# Altium project Board2.PrjPcb
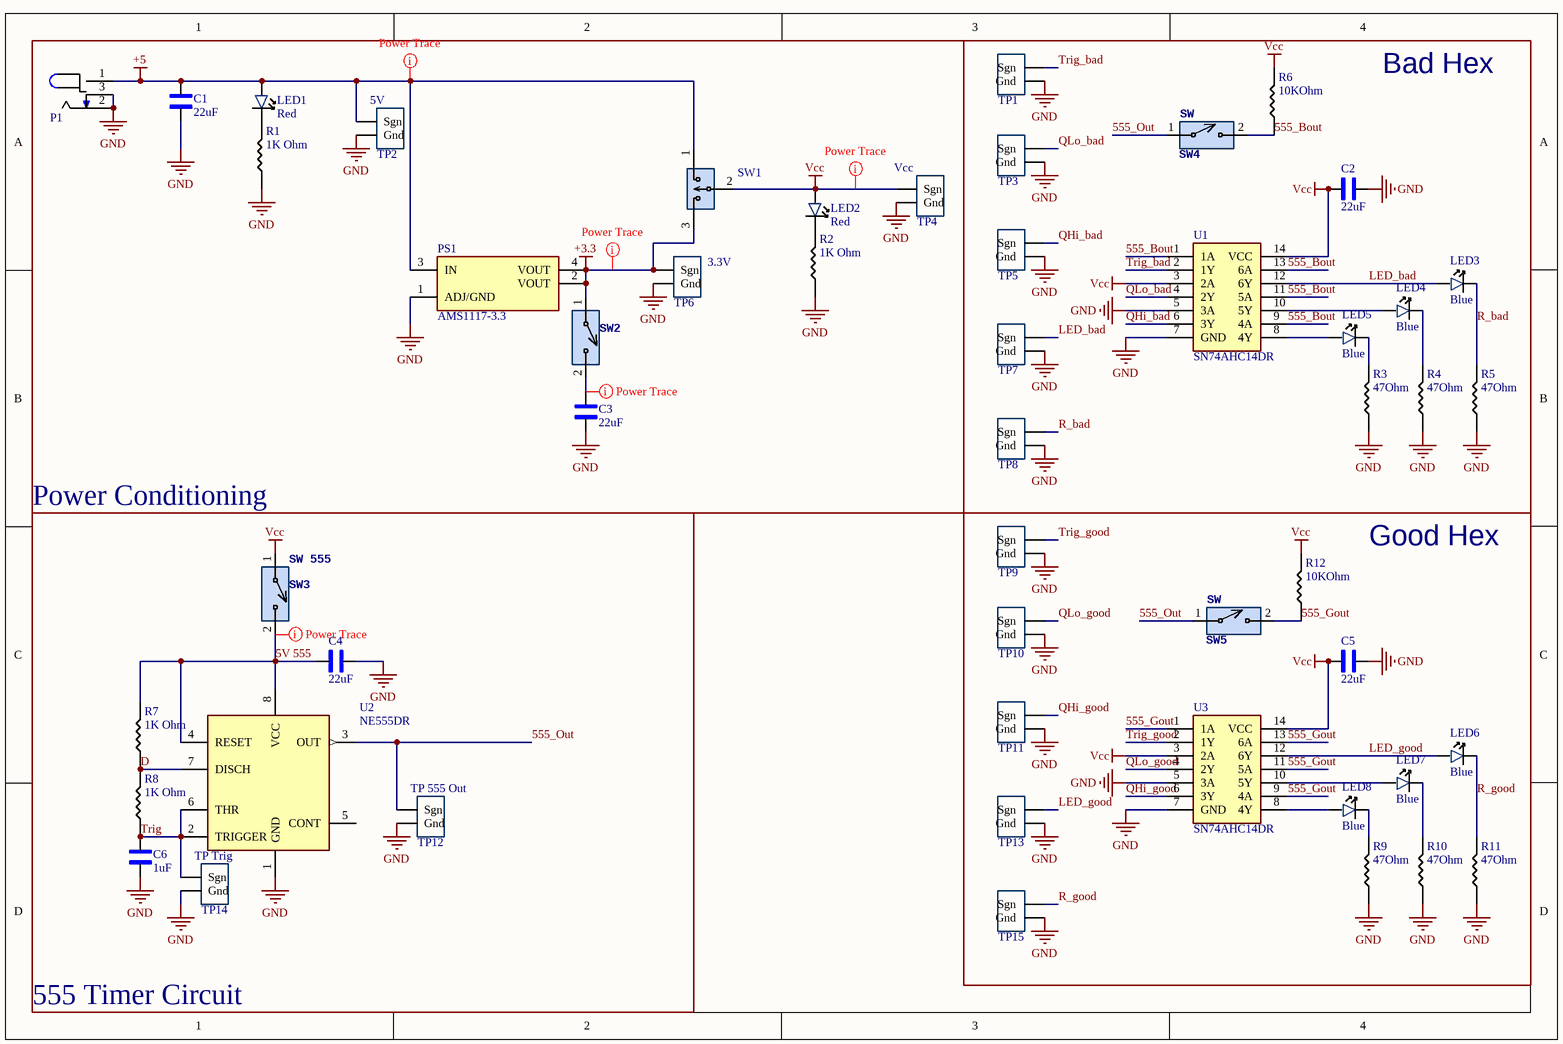
[diagram p0: Board2.SchDoc]
1 sheet, 51 parts. Net scope: global (net labels, ports and power ports of the same name join across sheets).
Board file: Board2.PcbDoc

## Sheet Board2.SchDoc
size A4; SheetNumber: 1; SheetTotal: 1

### Parts
C1  22uF  [1206_Passive_Capacitor]
C2  22uF  [1206_Passive_Capacitor]
C3  22uF  [1206_Passive_Capacitor]
C4  22uF  [1206_Passive_Capacitor]
C5  22uF  [1206_Passive_Capacitor]
C6  1uF  [1206_Passive_Capacitor]
LED1  Red  [LED_1206]
LED2  Red  [LED_1206]
LED3  Blue  [LED_1206]
LED4  Blue  [LED_1206]
LED5  Blue  [LED_1206]
LED6  Blue  [LED_1206]
LED7  Blue  [LED_1206]
LED8  Blue  [LED_1206]
P1  Power Jack  [Power_Jack]  (value not drawn)
PS1  AMS1117-3.3  [LDO]
R1  value 1K Ohm  [1206_Passive_Resitor]  (hidden comment: 1k)
R2  value 1K Ohm  [1206_Passive_Resitor]  (hidden comment: 1k)
R3  value 47Ohm  [1206_Passive_Resitor]  (hidden comment: 47 Ohms)
R4  value 47Ohm  [1206_Passive_Resitor]  (hidden comment: 47 Ohms)
R5  value 47Ohm  [1206_Passive_Resitor]  (hidden comment: 47 Ohms)
R6  value 10KOhm  [1206_Passive_Resitor]  (hidden comment: 10k)
R7  value 1K Ohm  [1206_Passive_Resitor]  (hidden comment: 1k)
R8  value 1K Ohm  [1206_Passive_Resitor]  (hidden comment: 1k)
R9  value 47Ohm  [1206_Passive_Resitor]  (hidden comment: 47 Ohms)
R10  value 47Ohm  [1206_Passive_Resitor]  (hidden comment: 47 Ohms)
R11  value 47Ohm  [1206_Passive_Resitor]  (hidden comment: 47 Ohms)
R12  value 10KOhm  [1206_Passive_Resitor]  (hidden comment: 10k)
SW1  PREC003SAAN-RC  [3_PIN_100mil]  (value not drawn)
SW2  SW_2Pin_100mil_Switch  [2Pin-Header-Conn]  (value not drawn)
SW3  SW 555  [2Pin-Header-Conn]
SW4  SW  [2Pin-Header-Conn]
SW5  SW  [2Pin-Header-Conn]
TP1  10x Probe TP  [TP10x_Probe]  (value not drawn)
TP2  5V  [TP10x_Probe]
TP3  10x Probe TP  [TP10x_Probe]  (value not drawn)
TP4  Vcc  [TP10x_Probe]
TP5  10x Probe TP  [TP10x_Probe]  (value not drawn)
TP6  3.3V  [TP10x_Probe]
TP7  10x Probe TP  [TP10x_Probe]  (value not drawn)
TP8  10x Probe TP  [TP10x_Probe]  (value not drawn)
TP9  10x Probe TP  [TP10x_Probe]  (value not drawn)
TP10  10x Probe TP  [TP10x_Probe]  (value not drawn)
TP11  10x Probe TP  [TP10x_Probe]  (value not drawn)
TP12  TP 555 Out  [TP10x_Probe]
TP13  10x Probe TP  [TP10x_Probe]  (value not drawn)
TP14  TP Trig  [TP10x_Probe]
TP15  10x Probe TP  [TP10x_Probe]  (value not drawn)
U1  SN74AHC14DR  [HEX_74AC14]
U2  NE555DR  [TS555IDTTR]
U3  SN74AHC14DR  [HEX_74AC14]

### Blocks framed on the sheet
Power Conditioning: C1 C3 LED1 LED2 P1 PS1 R1 R2 SW1 SW2 TP2 TP4 TP6
Bad Hex: C2 LED3-LED5 R3-R6 SW4 TP1 TP3 TP5 TP7 TP8 U1
Good Hex: C5 LED6-LED8 R9-R12 SW5 TP9-TP11 TP13 TP15 U3

### Nets
+3.3: PS1.2(VOUT) PS1.4(VOUT) SW1.3 SW2.1 TP6.1(Sgn)
+5: C1.2 LED1.1 P1.1 PS1.3(IN) SW1.1 TP2.1(Sgn)
GND: C1.1 C2.2 C3.1 C4.1 C5.2 C6.1 P1.2 P1.3 PS1.1(ADJ/GND) R1.1 R2.1 R3.1 R4.1 R5.1 R9.1 R10.1 R11.1 TP1.2(Gnd) TP2.2(Gnd) TP3.2(Gnd) TP4.2(Gnd) TP5.2(Gnd) TP6.2(Gnd) TP7.2(Gnd) TP8.2(Gnd) TP9.2(Gnd) TP10.2(Gnd) TP11.2(Gnd) TP12.2(Gnd) TP13.2(Gnd) TP14.2(Gnd) TP15.2(Gnd) U1.5(3A) U1.7(GND) U2.1(GND) U3.5(3A) U3.7(GND)
Vcc: C2.1 C5.1 LED2.1 R6.2 R12.2 SW1.2 SW3.1 TP4.1(Sgn) U1.3(2A) U1.14(VCC) U3.3(2A) U3.14(VCC)
5V 555: C4.2 R7.2 SW3.2 U2.4(RESET) U2.8(VCC)
555_Bout: R6.1 SW4.2 U1.1(1A) U1.9(4A) U1.11(5A) U1.13(6A)
555_Gout: R12.1 SW5.2 U3.1(1A) U3.9(4A) U3.11(5A) U3.13(6A)
555_Out: SW4.1 SW5.1 TP12.1(Sgn) U2.3(OUT)
D: R7.1 R8.2 U2.7(DISCH)
LED_bad: LED3.1 TP7.1(Sgn) U1.12(6Y)
LED_good: LED6.1 TP13.1(Sgn) U3.12(6Y)
QHi_bad: TP5.1(Sgn) U1.6(3Y)
QHi_good: TP11.1(Sgn) U3.6(3Y)
QLo_bad: TP3.1(Sgn) U1.4(2Y)
QLo_good: TP10.1(Sgn) U3.4(2Y)
R_bad: LED3.2 R5.2 TP8.1(Sgn)
R_good: LED6.2 R11.2 TP15.1(Sgn)
Trig: C6.2 R8.1 TP14.1(Sgn) U2.2(TRIGGER) U2.6(THR)
Trig_bad: TP1.1(Sgn) U1.2(1Y)
Trig_good: TP9.1(Sgn) U3.2(1Y)
NetC3_2: C3.2 SW2.2
NetLED1_2: LED1.2 R1.2
NetLED2_2: LED2.2 R2.2
NetLED4_1: LED4.1 U1.10(5Y)
NetLED4_2: LED4.2 R4.2
NetLED5_1: LED5.1 U1.8(4Y)
NetLED5_2: LED5.2 R3.2
NetLED7_1: LED7.1 U3.10(5Y)
NetLED7_2: LED7.2 R10.2
NetLED8_1: LED8.1 U3.8(4Y)
NetLED8_2: LED8.2 R9.2

Not connected (* = marked no-connect by the designer): U2 5(CONT)

### Layout directives
rule Width Constraint [Pref Width = 20mil    Min Width = 10mil    Max Width = 100mil]: 5V 555, +3.3, +5, NetC3_2, Vcc

### Notes on the sheet
- 555 Timer Circuit

### Library data of the parts
C1-C5 = C_22uF_1206: 22uF ±10% 25V X5R 1206 Multilayer Ceramic Capacitors MLCC - SMD/SMT RoHS; MFR Part #: CL31A226KAHNNNE; Type: basic; LCSC Part#: C12891; Datasheet: https://datasheet.lcsc.com/lcsc/1811031514_Samsung-Electro-Mechanics-CL31A226KAHNNNE_C12891.pdf; Value: 22uF
C6 = C_1uF_1206: MULTILAYER CERAMIC CAPACITORS MLCC - SMD/SMT 1UF 50V 1206 ROHS; MFR Part #: CL31B105KBHNNNE; Type: Basic; Digikey Link: https://www.digikey.com/product-detail/en/C1206C105M4RACTU/399-8150-1-ND/3471873/?itemSeq=304982366; LCSC Part#: C1848; Value: 1uF
LED1 LED2 = LED_RED_1206: Red 621~631nm 1206 Light Emitting Diodes (LED) RoHS; MFR Part #: 15-21/R6C-FQ1R1B/2T; Type: Extended; LCSC Part#: C93133; Datasheet: https://datasheet.lcsc.com/szlcsc/1811151241_Everlight-Elec-15-21-R6C-FQ1R1B-2T_C93133.pdf; Value: Red
LED3-LED8 = LED_BLUE_1206: blue 1206  Light Emitting Diodes (LED) ROHS; MFR Part #: NCD1206B1; Type: Extended; LCSC Part#: C130717; Datasheet: https://datasheet.lcsc.com/lcsc/2008201033_Foshan-NationStar-Optoelectronics-NCD1206B1_C130717.pdf; Value: Blue
P1 = P_Power Jack: Power Barrel Connector Jack 2.10mm ID (0.083"), 5.50mm OD (0.217") Through Hole, Right Angle; MFR Part #: PJ-102A; Value: CONN PWR JACK 2X5.5MM SOLDER; Digikey Link: https://www.digikey.com/product-detail/en/PJ-102A/CP-102A-ND/275425/?itemSeq=304982367; LCSC Part#: C136744; Type: Extended
PS1 = PS_AMS_LDO_3v3: LOW DROPOUT REGULATORS(LDO) POSITIVE FIXED 1.3V @ 800MA 15V 3.3V 1A SOT-223 ROHS; Value: IC REG LINEAR 3.3V 800MA SOT223; MFR Part #: AMS1117-3.3; LCSC Part#: C6186; Type: Basic
R1 R2 R7 R8 = R_1K_1206: CHIP RESISTOR - SURFACE MOUNT 1KOHMS ±1% 1/4W 1206 ROHS; MFR Part #: RNCP1206FTD1K00CT; Digikey Link: https://www.digikey.com/product-detail/en/RNCP1206FTD1K00/RNCP1206FTD1K00CT-ND/2240675/?itemSeq=304982373; LCSC Part#: C4410; Type: Basic
R3-R5 R9-R11 = R_47Ohm_1206: 47Ω ±5% 0.25W ±200ppm/℃ 1206 Chip Resistor - Surface Mount RoHS; MFR Part #: 1206W4J0470T5E; LCSC Part#: C25384; Type: Extended; Datasheet: https://datasheet.lcsc.com/lcsc/1811101020_UNI-ROYAL-Uniroyal-Elec-1206W4J0470T5E_C25384.pdf
R6 R12 = R_10KOhm_1206: 10 kOhms ±5% 0.25W, 1/4W Chip Resistor 1206 (3216 Metric) Automotive AEC-Q200 Thick Film; MFR Part #: RMCF1206FT10K0; Digikey Link: https://www.digikey.com/en/products/detail/stackpole-electronics-inc/RMCF1206FT10K0/1759669; LCSC Part#: C17902; Type: Basic
SW1 = SW_3Pin_100mil_Switch: Connector Header Through Hole 3 position 0.100" (2.54mm); Value: CONN HEADER VERT 3POS 2.54MM; Digikey Link: https://www.digikey.com/product-detail/en/PREC003SAAN-RC/S1012EC-03-ND/2774851/?itemSeq=304982371; MFR Part #: PREC003SAAN-RC; Type: Extended; LCSC Part#: C49257
SW2-SW5 = SW_2Pin_100mil_Switch: 2Pin Header; LCSC Part#: C124375; Type: Extended
TP1-TP15 = TP_10x_Probe: Test Point 300 mil centers
U1 U3 = U_74_AHC_Hex: Inverter IC 6 Channel Schmitt Trigger 14-SOIC; Datasheet: https://datasheet.lcsc.com/szlcsc/ON-Semicon-ON-74AC14SCX_C5482.pdf; MFR Part #: SN74AHC14DR; LCSC Part#: C6942; Type: Extended
U2 = U_555_Slow: 555 Timer SOIC-8_150MIL ROHS 150ns Rise Time; MFR Part #: NE555DR; Digikey Link: https://www.digikey.com/product-detail/en/texas-instruments/NE555DR/296-6501-1-ND/372490; Type: Basic; LCSC Part#: C7593